# Altium project Sterownik.PrjPcb
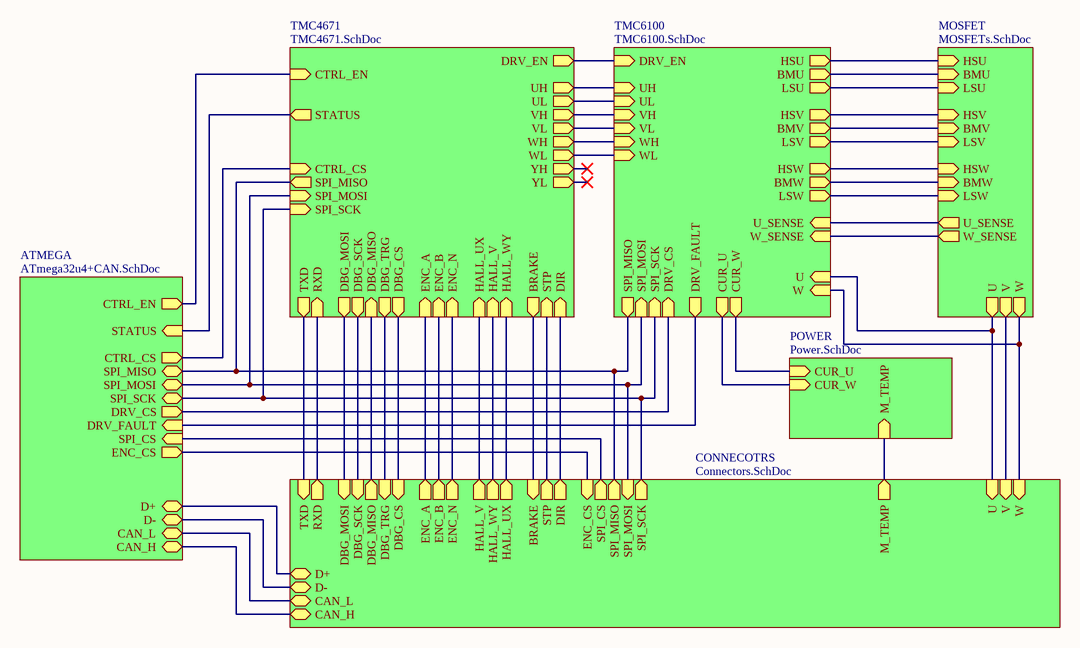
[diagram p0: Sterownik.SchDoc]
2 sheets, 36 parts. Net scope: hierarchical (ports join the sheet entries above them; power ports are global).
Board file: PCB1.PcbDoc
Sheets:
  Sterownik.SchDoc
    ATMEGA = ATmega32u4+CAN.SchDoc

## Sheet Sterownik.SchDoc
size A4; SheetNumber: 1; SheetTotal: 7

### Sub-sheets
ATMEGA = ATmega32u4+CAN.SchDoc: DRV_FAULT (in), SPI_CS (in), STATUS (in), CAN_H (bidir), CAN_L (bidir), D+ (bidir), D- (bidir), SPI_MISO (bidir), SPI_MOSI (bidir), SPI_SCK (bidir), DRV_CS (out), CTRL_CS (out), ENC_CS (out), CTRL_EN (out)
CONNECOTRS = Connectors.SchDoc (file not in this document): M_TEMP (out), ENC_A (out), ENC_B (out), HALL_UX (out), HALL_V (out), HALL_WY (out), SPI_MISO (out), SPI_MOSI (in), SPI_SCK (out), SPI_CS (out), DBG_TRG (in), DBG_MISO (out), DBG_MOSI (in), DBG_SCK (in), DBG_CS (in), U (in), V (in), W (in), CAN_L (bidir), CAN_H (bidir), ENC_N (out), RXD (out), TXD (in), ENC_CS (in), D- (bidir), D+ (bidir), DIR (out), STP (out), BRAKE (in)
MOSFET = MOSFETs.SchDoc (file not in this document): U (out), U_SENSE (out), V (out), W (out), W_SENSE (out), BMU (in), BMV (in), BMW (in), HSU (in), HSV (in), HSW (in), LSU (in), LSV (in), LSW (in)
POWER = Power.SchDoc (file not in this document): CUR_W (in), CUR_U (in), M_TEMP (in)
TMC4671 = TMC4671.SchDoc (file not in this document): CTRL_CS (in), CTRL_EN (in), DBG_MISO (in), ENC_A (in), ENC_B (in), ENC_N (in), HALL_UX (in), HALL_V (in), HALL_WY (in), RXD (in), SPI_MOSI (in), SPI_SCK (in), BRAKE (out), DBG_CS (out), DBG_MOSI (out), DBG_SCK (out), DBG_TRG (out), DRV_EN (out), SPI_MISO (out), STATUS (out), TXD (out), UH (out), UL (out), VH (out), VL (out), WH (out), WL (out), YH (out), YL (out), STP (in), DIR (in)
TMC6100 = TMC6100.SchDoc (file not in this document): DRV_CS (in), DRV_EN (in), SPI_MOSI (in), SPI_SCK (in), U (in), UH (in), UL (in), U_SENSE (in), VH (in), VL (in), W (in), WH (in), WL (in), W_SENSE (in), BMU (out), BMV (out), BMW (out), CUR_U (out), CUR_W (out), DRV_FAULT (out), HSU (out), HSV (out), HSW (out), LSU (out), LSV (out), LSW (out), SPI_MISO (out)

### Nets
NetR502_1: sheet CONNECOTRS/D+, sheet ATMEGA/D+
NetR503_1: sheet CONNECOTRS/D-, sheet ATMEGA/D-
NetR505_2: sheet TMC6100/DRV_FAULT, sheet ATMEGA/DRV_FAULT
NetR506_2: sheet TMC4671/STATUS, sheet ATMEGA/STATUS
NetU501_14: sheet TMC4671/SPI_SCK, sheet TMC6100/SPI_SCK, sheet CONNECOTRS/SPI_SCK, sheet ATMEGA/SPI_SCK
NetU501_16: sheet TMC4671/SPI_MOSI, sheet TMC6100/SPI_MOSI, sheet CONNECOTRS/SPI_MOSI, sheet ATMEGA/SPI_MOSI
NetU501_17: sheet TMC4671/SPI_MISO, sheet TMC6100/SPI_MISO, sheet CONNECOTRS/SPI_MISO, sheet ATMEGA/SPI_MISO
NetU502_6: sheet CONNECOTRS/CAN_L, sheet ATMEGA/CAN_L
NetU502_7: sheet CONNECOTRS/CAN_H, sheet ATMEGA/CAN_H
NetU503_8: sheet CONNECOTRS/SPI_CS, sheet ATMEGA/SPI_CS
NetU503_22: sheet TMC4671/CTRL_CS, sheet ATMEGA/CTRL_CS
NetU503_25: sheet TMC6100/DRV_CS, sheet ATMEGA/DRV_CS
NetU503_26: sheet CONNECOTRS/ENC_CS, sheet ATMEGA/ENC_CS
NetU503_36: sheet TMC4671/CTRL_EN, sheet ATMEGA/CTRL_EN
(unnamed): sheet TMC4671/DBG_MISO, sheet CONNECOTRS/DBG_MISO
(unnamed): sheet TMC4671/ENC_A, sheet CONNECOTRS/ENC_A
(unnamed): sheet TMC4671/ENC_B, sheet CONNECOTRS/ENC_B
(unnamed): sheet TMC4671/ENC_N, sheet CONNECOTRS/ENC_N
(unnamed): sheet TMC4671/HALL_UX, sheet CONNECOTRS/HALL_V
(unnamed): sheet TMC4671/HALL_V, sheet CONNECOTRS/HALL_WY
(unnamed): sheet TMC4671/HALL_WY, sheet CONNECOTRS/HALL_UX
(unnamed): sheet TMC4671/RXD, sheet CONNECOTRS/RXD
(unnamed): sheet TMC4671/BRAKE, sheet CONNECOTRS/BRAKE
(unnamed): sheet TMC4671/DBG_CS, sheet CONNECOTRS/DBG_CS
(unnamed): sheet TMC4671/DBG_MOSI, sheet CONNECOTRS/DBG_MOSI
(unnamed): sheet TMC4671/DBG_SCK, sheet CONNECOTRS/DBG_SCK
(unnamed): sheet TMC4671/DBG_TRG, sheet CONNECOTRS/DBG_TRG
(unnamed): sheet TMC4671/DRV_EN, sheet TMC6100/DRV_EN
(unnamed): sheet TMC4671/TXD, sheet CONNECOTRS/TXD
(unnamed): sheet TMC4671/UH, sheet TMC6100/UH
(unnamed): sheet TMC4671/UL, sheet TMC6100/UL
(unnamed): sheet TMC4671/VH, sheet TMC6100/VH
(unnamed): sheet TMC4671/VL, sheet TMC6100/VL
(unnamed): sheet TMC4671/WH, sheet TMC6100/WH
(unnamed): sheet TMC4671/WL, sheet TMC6100/WL
(unnamed): sheet TMC4671/STP, sheet CONNECOTRS/STP
(unnamed): sheet TMC4671/DIR, sheet CONNECOTRS/DIR
(unnamed): sheet TMC6100/U, sheet CONNECOTRS/U, sheet MOSFET/U
(unnamed): sheet TMC6100/U_SENSE, sheet MOSFET/U_SENSE
(unnamed): sheet TMC6100/W, sheet CONNECOTRS/W, sheet MOSFET/W
(unnamed): sheet TMC6100/W_SENSE, sheet MOSFET/W_SENSE
(unnamed): sheet TMC6100/BMU, sheet MOSFET/BMU
(unnamed): sheet TMC6100/BMV, sheet MOSFET/BMV
(unnamed): sheet TMC6100/BMW, sheet MOSFET/BMW
(unnamed): sheet TMC6100/CUR_U, sheet POWER/CUR_W
(unnamed): sheet TMC6100/CUR_W, sheet POWER/CUR_U
(unnamed): sheet TMC6100/HSU, sheet MOSFET/HSU
(unnamed): sheet TMC6100/HSV, sheet MOSFET/HSV
(unnamed): sheet TMC6100/HSW, sheet MOSFET/HSW
(unnamed): sheet TMC6100/LSU, sheet MOSFET/LSU
(unnamed): sheet TMC6100/LSV, sheet MOSFET/LSV
(unnamed): sheet TMC6100/LSW, sheet MOSFET/LSW
(unnamed): sheet POWER/M_TEMP, sheet CONNECOTRS/M_TEMP
(unnamed): sheet CONNECOTRS/V, sheet MOSFET/V

## Sheet ATmega32u4+CAN.SchDoc
size A4; SheetNumber: 5; SheetTotal: 7
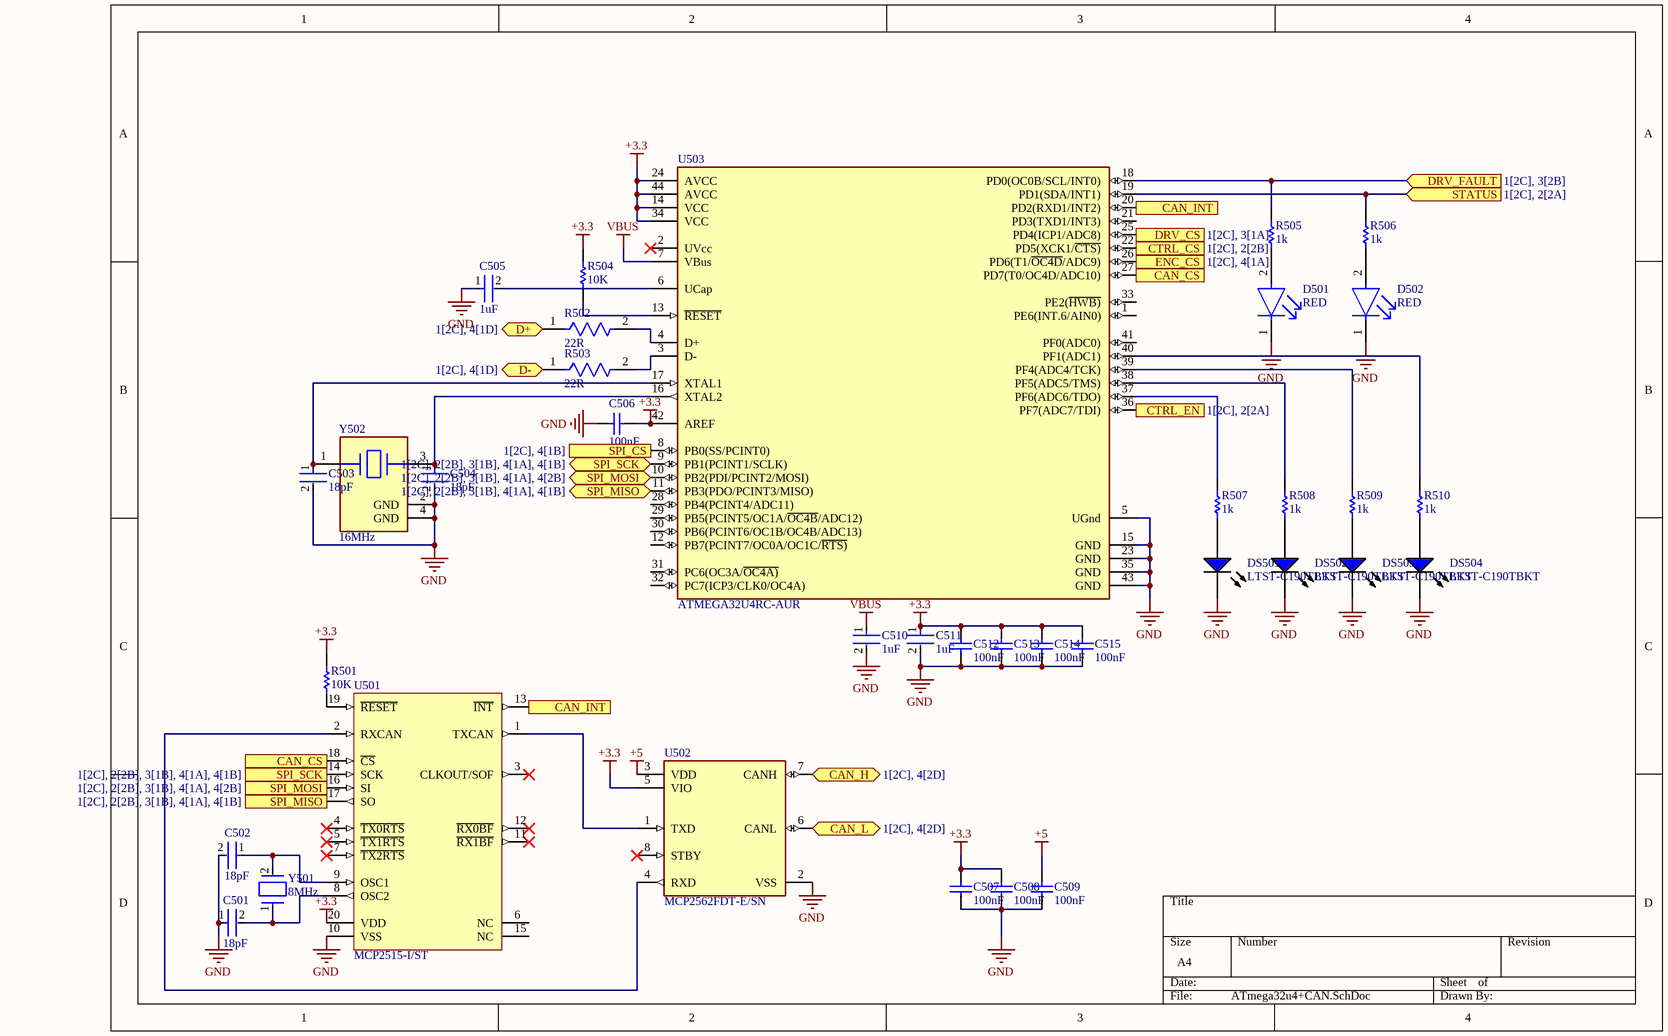
[diagram p1: ATmega32u4+CAN.SchDoc]

### Parts
C501  18pF  [FP-C0603C-CF-IPC_B]
C502  18pF  [FP-C0603C-CF-IPC_B]
C503  18pF  [FP-C0603C-CF-IPC_B]
C504  18pF  [FP-C0603C-CF-IPC_B]
C505  1uF  [FP-CL10-IPC_B]
C506  100nF  [CAPC1608X90X35NL10T15]
C507  100nF  [CAPC1608X90X35NL10T15]
C508  100nF  [CAPC1608X90X35NL10T15]
C509  100nF  [CAPC1608X90X35NL10T15]
C510  1uF  [FP-CL10-IPC_B]
C511  1uF  [FP-CL10-IPC_B]
C512  100nF  [CAPC1608X90X35NL10T15]
C513  100nF  [CAPC1608X90X35NL10T15]
C514  100nF  [CAPC1608X90X35NL10T15]
C515  100nF  [CAPC1608X90X35NL10T15]
D501  RED  [FP-LTST-C190KRKT-MFG]
D502  RED  [FP-LTST-C190KRKT-MFG]
DS501  LTST-C190TBKT  [LTST-C190TBKT-2_V]
DS502  LTST-C190TBKT  [LTST-C190TBKT-2_V]
DS503  LTST-C190TBKT  [LTST-C190TBKT-2_V]
DS504  LTST-C190TBKT  [LTST-C190TBKT-2_V]
R501  10K  [RESC1609X55X30LL15T15]
R502  22R  [FP-RMCF0603-IPC_B]
R503  22R  [FP-RMCF0603-IPC_B]
R504  10K  [RESC1609X55X30LL15T15]
R505  1k  [RESC1608X55X30ML15T15]
R506  1k  [RESC1608X55X30ML15T15]
R507  1k  [RESC1608X55X30ML15T15]
R508  1k  [RESC1608X55X30ML15T15]
R509  1k  [RESC1608X55X30ML15T15]
R510  1k  [RESC1608X55X30ML15T15]
U501  MCP2515-I/ST  [TSSOP-ST20_M]
U502  MCP2562FDT-E/SN  [FP-C04-057-SN-MFG]
U503  ATMEGA32U4RC-AUR  [FP-ML-MFG]
Y501  8MHz  [FP-ABM7-MFG]
Y502  16MHz  [FP-ABM8G-MFG]

### Ports
CAN_CS (in), CAN_CS (out), CAN_H (bidir, see 1[2C], 4[2D]), CAN_INT (in), CAN_INT (out), CAN_L (bidir, see 1[2C], 4[2D]), CTRL_CS (out, see 1[2C], 2[2B]), CTRL_EN (out, see 1[2C], 2[2A]), D+ (bidir, see 1[2C], 4[1D]), D- (bidir, see 1[2C], 4[1D]), DRV_CS (out, see 1[2C], 3[1A]), DRV_FAULT (in, see 1[2C], 3[2B]), ENC_CS (out, see 1[2C], 4[1A]), SPI_CS (in, see 1[2C], 4[1B]), SPI_MISO (bidir, see 1[2C], 2[2B], 3[1B], 4[1A], 4[1B]), SPI_MISO (out, see 1[2C], 2[2B], 3[1B], 4[1A], 4[1B]), SPI_MOSI (bidir, see 1[2C], 2[2B], 3[1B], 4[1A], 4[2B]), SPI_MOSI (in, see 1[2C], 2[2B], 3[1B], 4[1A], 4[2B]), SPI_SCK (bidir, see 1[2C], 2[2B], 3[1B], 4[1A], 4[1B]), SPI_SCK (in, see 1[2C], 2[2B], 3[1B], 4[1A], 4[1B]), STATUS (in, see 1[2C], 2[2A])

### Nets
+3.3: C506.1 C507.2 C508.2 C511.1 C512.2 C513.2 C514.2 C515.2 R501.2 R504.2 U501.20(VDD) U502.5(VIO) U503.14(VCC) U503.24(AVCC) U503.34(VCC) U503.42(AREF) U503.44(AVCC)
+5: C509.2 U502.3(VDD)
GND: C501.1 C502.2 C503.2 C504.2 C505.1 C506.2 C507.1 C508.1 C509.1 C510.2 C511.2 C512.1 C513.1 C514.1 C515.1 D501.1(C) D502.1(C) DS501.2(K) DS502.2(K) DS503.2(K) DS504.2(K) U501.10(VSS) U502.2(VSS) U503.5(UGnd) U503.15(GND) U503.23(GND) U503.35(GND) U503.43(GND) Y502.2(GND) Y502.4(GND)
VBUS: C510.1 U503.7(VBus)
NetC501_2: C501.2 U501.8(OSC2) Y501.1
NetC502_1: C502.1 U501.9(OSC1) Y501.2
NetC503_1: C503.1 U503.17(XTAL1) Y502.1
NetC504_1: C504.1 U503.16(XTAL2) Y502.3
NetC505_2: C505.2 U503.6(UCap)
NetD501_2: D501.2(A) R505.1
NetD502_2: D502.2(A) R506.1
NetDS501_1: DS501.1(A) R507.1
NetDS502_1: DS502.1(A) R508.1
NetDS503_1: DS503.1(A) R509.1
NetDS504_1: DS504.1(A) R510.1
NetR501_1: R501.1 U501.19(~{RESET})
NetR502_1: R502.1 ; port D+
NetR502_2: R502.2 U503.4(D+)
NetR503_1: R503.1 ; port D-
NetR503_2: R503.2 U503.3(D-)
NetR504_1: R504.1 U503.13(~{RESET})
NetR505_2: R505.2 U503.18(PD0(OC0B/SCL/INT0)) ; port DRV_FAULT
NetR506_2: R506.2 U503.19(PD1(SDA/INT1)) ; port STATUS
NetR507_2: R507.2 U503.37(PF6(ADC6/TDO))
NetR508_2: R508.2 U503.38(PF5(ADC5/TMS))
NetR509_2: R509.2 U503.39(PF4(ADC4/TCK))
NetR510_2: R510.2 U503.40(PF1(ADC1))
NetU501_1: U501.1(TXCAN) U502.1(TXD)
NetU501_2: U501.2(RXCAN) U502.4(RXD)
NetU501_13: U501.13(~{INT}) U503.20(PD2(RXD1/INT2)) ; port CAN_INT
NetU501_14: U501.14(SCK) U503.9(PB1(PCINT1/SCLK)) ; port SPI_SCK
NetU501_16: U501.16(SI) U503.10(PB2(PDI/PCINT2/MOSI)) ; port SPI_MOSI
NetU501_17: U501.17(SO) U503.11(PB3(PDO/PCINT3/MISO)) ; port SPI_MISO
NetU501_18: U501.18(~{CS}) U503.27(PD7(T0/OC4D/ADC10)) ; port CAN_CS
NetU502_6: U502.6(CANL) ; port CAN_L
NetU502_7: U502.7(CANH) ; port CAN_H
NetU503_8: U503.8(PB0(SS/PCINT0)) ; port SPI_CS
NetU503_22: U503.22(PD5(XCK1/~{CTS)}) ; port CTRL_CS
NetU503_25: U503.25(PD4(ICP1/ADC8)) ; port DRV_CS
NetU503_26: U503.26(PD6(T1/~{OC4D}/ADC9)) ; port ENC_CS
NetU503_36: U503.36(PF7(ADC7/TDI)) ; port CTRL_EN

Not connected (* = marked no-connect by the designer): U501 3(CLKOUT/SOF)* 4(~{TX0RTS})* 5(~{TX1RTS})* 6(NC) 7(~{TX2RTS})* 11(~{RX1BF})* 12(~{RX0BF})* 15(NC); U502 8(STBY)*; U503 1(PE6(INT.6/AIN0)) 2(UVcc)* 12(PB7(PCINT7/OC0A/OC1C/~{RTS)}) 21(PD3(TXD1/INT3)) 28(PB4(PCINT4/ADC11)) 29(PB5(PCINT5/OC1A/~{OC4B}/ADC12)) 30(PB6(PCINT6/OC1B/OC4B/ADC13)) 31(PC6(OC3A/~{OC4A)}) 32(PC7(ICP3/CLK0/OC4A)) 33(PE2(~{HWB)}) 41(PF0(ADC0))

### Library data of the parts
C501-C504 = CMP-03020-006972-1: C0603 18 pF X8R 30ppm/°C 10.00% 16 V; Manufacturer: KEMET; Manufacturer Part Number: C0603C180K4HAC7867; Material: Ceramic; Automotive Grade: Grade 1; Voltage Rating: 16 V; Tolerance: 0.1; Temperature Coefficient: 30ppm/°C; Temperature Range High: +125°C; ComponentLink2Description: Datasheet; Device Class L2: Capacitors; Package: C0603C-CF; RoHS: TRUE; Octopart: https://octopart.com/c0603c180k4hac7867-kemet-88085547; Device Class L1: Passive Components; Temperature Range Low: -55°C; Temperature: -55°C to +125°C; Device Class L3: Ceramic Capacitors; Automotive: Yes; Value: 18 pF; Height: 0.87mm; ComponentLink2URL: https://api.kemet.com/component-edge/download/datasheet/C0603C100J5GACAUTO.pdf; Capacitance: 18 pF; Temperature Characteristic: X8R; Category: Cap; Lead Free: Yes
C505 C510 C511 = CMP-13271-004127-1: Cap Ceramic 1uF 25V X5R ±10% Pad SMD 0603 +85°C T/R; Height: 0.8mm; Capacitance: 1uF; Depth: 0.8mm; Package Quantity: 1; Mount: Surface Mount; Contact Plating: Tin; Voltage Rating: 25V; Dielectric: X5R; Packaging: Tape and Reel; Material: Ceramic; Case Code (Metric): 1608; Length: 1.6mm; Voltage: 25V; Min Operating Temperature: -55°C; Width: 0.031inch; Tolerance: 10%; Case/Package: 0603; Radiation Hardening: No; Case Code (Imperial): 0603; Thickness: 0.035inch; Lead Free: Lead Free; Max Operating Temperature: 85°C; Voltage Rating (DC): 25V
C506-C509 C512-C515 = CMP-2100-03643-1: Chip Capacitor, 0.1 uF, +/- 10%, 50 V, -55 to 125 degC, 0603 (1608 Metric), RoHS, Tape and Reel; Manufacturer: Murata; Dielectric Material: Ceramic; Voltage Rating: 50V; Dielectric: X7R; Insulation Resistance: 10GR; Case Code (Metric): 1608; Lead Free: LeadFree; Depth: 0.8mm; Number of Pins: 2; Radiation Hardening: No; Case/Package: 0603; Manufacturer URL: http://www.murata.com/; Packaging: TapeandReel; Length: 1.6mm; Contact Plating: Tin; Datasheet URL: http://psearch.en.murata.com/capacitor/product/GRM188R71H104KA93%23.pdf; Tolerance: 10%; Case Code (Imperial): 0603; Min Operating Temperature: -55degC; RoHSCompliant: true; Capacitance: 100nF; Voltage: 50V; Termination: SMD/SMT; Mount: SurfaceMount; Material: Ceramic; Package Quantity: 1; Height: 0.8mm; Thickness: 0.035inch; REACH SVHC: NoSVHC; Max Operating Temperature: 125degC; Width: 0.8mm; Package Reference: 0603; Voltage Rating (DC): 50V; Datasheet Version: 42675.0; Package Description: 2-Pin Surface Mount Device, Body 1.6 x 0.8 mm
D501 D502 = CMP-1674-00011-2: LED RED CLEAR CHIP SMD; Reverse Voltage: 5V; Viewing Angle: 130°; Power Rating: 75mW; Test Current: 20mA; Number of Elements: 1; Lens Color: Colorless; Wavelength: 639nm; Dominant Wavelength: 631nm; Lens Style: Diffused; Forward Current: 30mA; Forward Voltage: 2.4V; Luminous Intensity: 54mcd; Color: Red; Case Code (Imperial): 0603; Lens Transparency: Clear; Lead Free: Lead Free; Package Quantity: 1; Packaging: Tape and Reel; Max Operating Temperature: 85°C; Number of Pins: 2; Height: 0.8mm; Case/Package: 0603; Number of LEDs: 1; Width: 0.8mm; Case Code (Metric): 1608; Depth: 0.8mm; Mount: Surface Mount; Radiation Hardening: No; Length: 1.6mm; Illumination Color: Red; Power Dissipation: 75mW; Min Operating Temperature: -55°C
DS501-DS504 = CMP-1674-00010-1: Single Color Chip LED, 2.8 to 3.8 V, 28 to 180 mcd, -20 to 80 degC, 2-Pin SMD, RoHS, Tape and Reel; Nominal Supply Voltage: 3 V; Min Supply Voltage: 2.1 V; Interface: Serial; Case\Package: DFN; Max Supply Voltage: 3.6 V; Min Operating Temperature: -40 degC; ComponentLink2URL: http://optoelectronics.liteon.com/upload/download/DS-22-99-0224/S_110_LTST-C190TBKT(0630).pdf; Length: 3 mm; PackageReference: C190TBKT-2; Packaging: Cut Tape; RoHSCompliant: true; DatasheetVersion: Rev. K, 08/2011; Width: 3 mm; Pins: 6; Height: 1.1 mm; Max Operating Temperature: 125 degC; Mount: Surface Mount; PackageDescription: 2-Pin Surface Mount Device, Body 1.6 x 0.8 mm; ComponentLink1Description: Manufacturer URL; ComponentLink1URL: http://www.us.liteon.com/; REACH SVHC: No SVHC; ComponentLink2Description: Datasheet
R501 R504 = CMP-1012-00623-3: Chip Resistor, 10 KOhm, +/- 1%, 0.1 W, -55 to 155 degC, 0603 (1608 Metric), RoHS, Tape and Reel; Manufacturer: Panasonic; Voltage Rating: 75V; Case\/Package: 0603; Power Rating: 100mW; Resistance: 10KOhm; Temperature Coefficient: 100ppm\/degreesC; Number of Pins: 2; Package Reference: 603; Depth: 0.8mm; Mount: SurfaceMount; Package Description: 2-Pin Surface Mount Device, Body 1.6 x 0.85 mm; Datasheet Version: 02/2017; Length: 1.6mm; Lead Free: LeadFree; Height: 0.45mm; Number of Terminations: 2; Max Power Dissipation: 100mW; Min Operating Temperature: -55degC; Datasheet URL: https://industrial.panasonic.com/cdbs/www-data/pdf/RDA0000/AOA0000C304.pdf; Termination: SMD/SMT; Case Code (Metric): 1608; Case Code (Imperial): 0603; Tolerance: 1%; Max Operating Temperature: 155degC; RoHSCompliant: true; Voltage Rating (DC): 75V; Radiation Hardening: No; Packaging: TapeandReel; Composition: ThickFilm; Mounting Technology: SurfaceMount; Manufacturer URL: http://www.panasonic.com/; Width: 0.031inch; REACH SVHC: NoSVHC; Contact Plating: Tin; Military Standard: Not; Package Quantity: 1
R502 R503 = CMP-26527-001634-1: 22Ω ±5% 0.1W 0603 Thick Film Chip Resistor AEC-Q200 compliant; Temperature Coefficient: 100ppm/°C; Max Power Dissipation: 100mW; Width: 0.031inch; Tolerance: 5%; Case/Package: 0603; Features: Automotive AEC-Q200; Case Code (Metric): 1608; Height: 0.022inch; Case Code (Imperial): 0603; Mount: Surface Mount; Resistance: 22R; Packaging: Tape and Reel; Power Rating: 100mW; Series: RMCF; Length: 0.061inch; Contact Plating: Tin; RoHS Compliant: Yes; Min Operating Temperature: -55°C; Size Code: 0603; Number of Terminations: 2; Resistor Type: Thick Film; Lead Free: Lead Free; Max Operating Temperature: 155°C; Radiation Hardening: No
R505-R510 = CMP-2000-00180-1: Part Number: ERJ-3EKF1001V; Manufacturer: Panasonic
U501 = CMP-0186-00077-2: Stand-Alone CAN Controller With SPI Interface, 20-Pin TSSOP, Industrial Temperature; DatasheetVersion: revF, Oct-2010; ComponentLink1Description: Manufacturer URL; PackageDescription: 20-Lead Plastic Thin Shrink Small Outline (ST) - 4.4mm Body [TSSOP]; ComponentLink1URL: http://www.microchip.com/; RevisionNote: URLs added. DatasheetVersion updated.; PackageReference: TSSOP-ST20; Code_JEDEC: MO-153-AC; ComponentLink2Description: Datasheet; ComponentLink2URL: http://ww1.microchip.com/downloads/en/DeviceDoc/21801f.pdf; PackageVersion: revBB, Aug-2009; ComponentLink3URL: http://www.microchip.com/stellent/groups/techpub_sg/documents/packagingspec/en012702.pdf; ComponentLink3Description: Package Specification
U502 = CMP-06279-000005-1: IC TRANSCEIVER 1/1 8SOIC; Operating Supply Current: 70mA; Data Rate: 8Mbps; Number of Transceivers: 1; Receiver Hysteresis: 200mV; Max Supply Voltage: 5.5V; Min Supply Voltage: 4.5V; Weight: 0.019048oz; Package Quantity: 3300; Case/Package: SOIC; Mount: Surface Mount; Max Operating Temperature: 125°C; Min Operating Temperature: -40°C; Packaging: Tape and Reel; Number of Pins: 8
U503 = CMP-06276-000452-1: IC MCU 8BIT 32KB FLASH 44TQFP; Number of Timers/Counters: 4; Min Supply Voltage: 2.7V; Number of I/Os: 26; Data Bus Width: 8b; Interface: I2C; Max Frequency: 16MHz; RAM Size: 2.5KB; Peripherals: Brown-out Detect/Reset; Oscillator Type: Internal; Core Architecture: AVR; Max Supply Voltage: 5.5V; Series: AVR® ATmega; Min Operating Temperature: -40°C; Number of Pins: 44; Memory Type: FLASH; Frequency: 16MHz; Mount: Surface Mount; Case/Package: TQFP; Packaging: Tape and Reel; Memory Size: 32KB; Package Quantity: 1500; Max Operating Temperature: 85°C
Y501 = CMP-2000-05034-2: Crystal 8MHz ±20ppm 18pF SMD-2 6mm x 3.5mm; ESR (Equivalent Series Resistance): 100R; Series Resistance: 80R; Frequency Stability: 30ppm; Resistor Type: Ceramic; Radiation Hardening: No; Height: 0.055inch; Packaging: Tape and Reel; Lead Free: Lead Free; Min Operating Temperature: -40°C; Termination: SMD/SMT; REACH SVHC: Yes; Number of Pins: 2; Mount: Surface Mount; Case/Package: CSMD; Tolerance: 20ppm; Max Operating Temperature: 85°C; Series: ABM7; Frequency Tolerance: 20ppm; Load Capacitance: 18pF; Length: 6mm; Frequency: 8MHz; Width: 0.138inch; Package Quantity: 1000; Depth: 3.5mm; Operating Frequency: 8 MHz
Y502 = CMP-27762-006537-2: Crystal 16MHz ±20ppm (Tol) ±30ppm (Stability) 18pF FUND 80Ω 4-Pin SMD T/R; Series Resistance: 80R; Radiation Hardening: No; Load Capacitance: 18pF; Package Quantity: 1000; Frequency Stability: 30ppm; ESR (Equivalent Series Resistance): 80R; Depth: 2.5mm; Height: 1mm; Number of Pins: 4; Frequency Tolerance: 20ppm; Frequency: 16MHz; Tolerance: 20ppm; Min Operating Temperature: -40°C; Length: 3.2mm; Termination: SMD/SMT; Max Operating Temperature: 85°C; Width: 2.5mm; Series: ABM8G; Mount: Surface Mount; Case/Package: CSMD; Lead Free: Lead Free; Operating Frequency: 16 MHz; Packaging: Tape and Reel

## Assembly variants
Prefered: not fitted C102 C105 C107 C109 J403 J404 P403 P404 P405 P406 P408 P409 R102 R104 R106 R109 R111 R112 U102
Full: all parts fitted